# Altium schematic sheet u2f.SchDoc
size A4
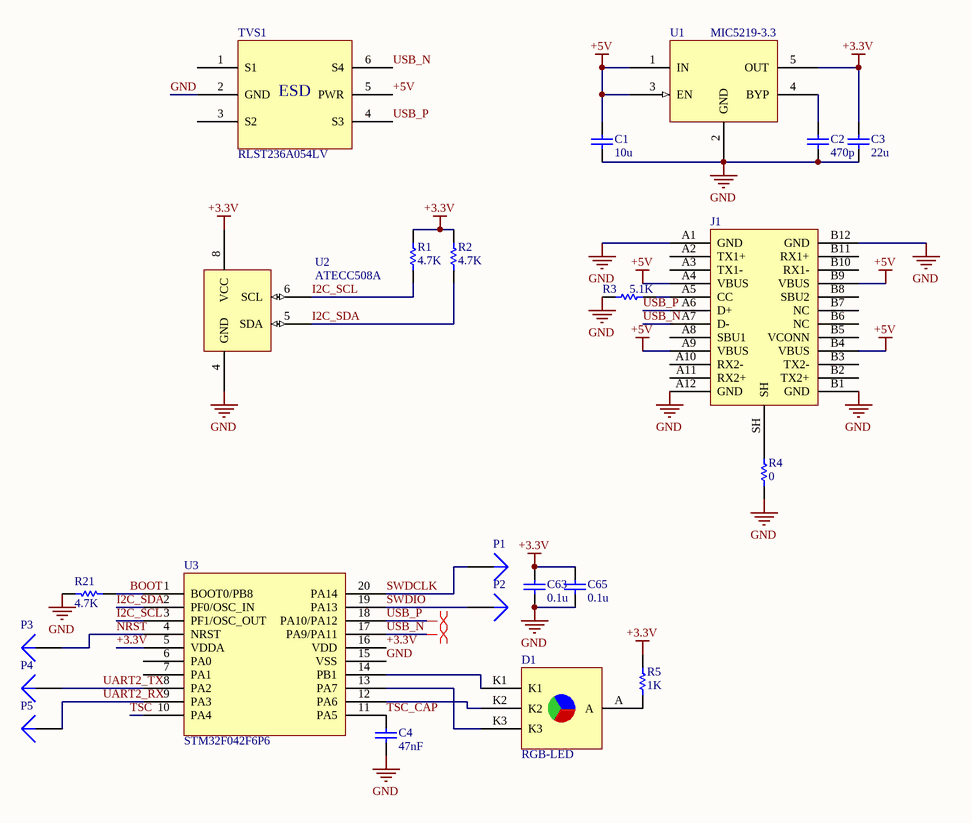
[diagram p0: u2f.SchDoc]

## Parts
C1  value 10u  [C-1608[0603]]  (hidden comment: Cap Semi)
C2  value 470p  [C-1608[0603]]  (hidden comment: Cap Semi)
C3  value 22u  [C-1608[0603]]  (hidden comment: Cap Semi)
C4  value 47nF  [C-1608[0603]]  (hidden comment: Cap Semi)
C63  value 0.1u  [C-1608[0603]]  (hidden comment: Cap Semi)
C65  value 0.1u  [C-1608[0603]]  (hidden comment: Cap Semi)
D1  RGB-LED  [LED-1615[0603x2]-RGB]
J1  USB-TypeC-Male  [USB-TypeC-Male]  (value not drawn)
P1  Plug  [TESTPOINT]  (value not drawn)
P2  Plug  [TESTPOINT]  (value not drawn)
P3  Plug  [TESTPOINT]  (value not drawn)
P4  Plug  [TESTPOINT]  (value not drawn)
P5  Plug  [TESTPOINT]  (value not drawn)
R1  value 4.7K  [R-1608[0603]]  (hidden comment: Res Semi)
R2  value 4.7K  [R-1608[0603]]  (hidden comment: Res Semi)
R3  value 5.1K  [R-1608[0603]]  (hidden comment: Res Semi)
R4  value 0  [R-1608[0603]]  (hidden comment: Res Semi)
R5  value 1K  [R-1608[0603]]  (hidden comment: Res Semi)
R21  value 4.7K  [R-1608[0603]]  (hidden comment: Res Semi)
TVS1  RLST236A054LV  [SOT23-6]
U1  MIC5219-3.3  [SOT23-5]
U2  ATECC508A  [SOP8-3D]
U3  STM32F042F6P6  [TSOP65P640X120-20N]

## Nets
+3.3V: C3.2 C63.2 C65.2 R1.2 R2.2 R5.2 U1.5(OUT) U2.8(VCC) U3.5(VDDA) U3.16(VDD)
+5V: C1.2 J1.A4(VBUS) J1.A9(VBUS) J1.B4(VBUS) J1.B9(VBUS) TVS1.5(PWR) U1.1(IN) U1.3(EN)
GND: C1.1 C2.1 C3.1 C4.1 C63.1 C65.1 J1.A1(GND) J1.A12(GND) J1.B1(GND) J1.B12(GND) R3.2 R4.1 R21.2 TVS1.2(GND) U1.2(GND) U2.4(GND) U3.15(VSS)
BOOT: R21.1 U3.1(BOOT0/PB8)
I2C_SCL: R1.1 U2.6(SCL) U3.3(PF1/OSC_OUT)
I2C_SDA: R2.1 U2.5(SDA) U3.2(PF0/OSC_IN)
NRST: P3.1 U3.4(NRST)
SWDCLK: P1.1 U3.20(PA14)
SWDIO: P2.1 U3.19(PA13)
TSC: U3.10(PA4)
TSC_CAP: C4.2 U3.11(PA5)
UART2_RX: P5.1 U3.9(PA3)
UART2_TX: P4.1 U3.8(PA2)
USB_N: J1.A7(D-) TVS1.6(S4) U3.17(PA9/PA11)
USB_P: J1.A6(D+) TVS1.4(S3) U3.18(PA10/PA12)
NetC2_2: C2.2 U1.4(BYP)
NetD1_A: D1.A R5.1
NetD1_K1: D1.K1 U3.14(PB1)
NetD1_K2: D1.K2 U3.12(PA6)
NetD1_K3: D1.K3 U3.13(PA7)
NetJ1_A5: J1.A5(CC) R3.1
NetJ1_SH: J1.SH R4.2

Not connected (* = marked no-connect by the designer): J1 A2(TX1+) A3(TX1-) A8(SBU1) A10(RX2-) A11(RX2+) B2(TX2+) B3(TX2-) B5(VCONN) B6(NC) B7(NC) B8(SBU2) B10(RX1-) B11(RX1+); TVS1 1(S1) 3(S2); U3 6(PA0) 7(PA1)

## Layout directives
differential pair: USB_N, USB_P

## Notes on the sheet
- (in symbol RLST236A054LV) ESD

## Library data of the parts
C1-C4 C63 C65 = Cap Semi: Capacitor (Semiconductor SIM Model); Published: 8-Jun-2000; LatestRevisionDate: 29-May-2009; LatestRevisionNote: IPC-7351 Footprint Added.; PackageReference: C1206; Publisher: Altium Limited; PackageDescription: Chip Capacitor
D1 = RGBLED_CA
R1-R5 R21 = Res Semi: Semiconductor Resistor; Published: 8-Jun-2000; LatestRevisionDate: 17-Jul-2002; LatestRevisionNote: Re-released for DXP Platform.; PackageReference: AXIAL-0.5; Publisher: Altium Limited; PackageDescription: Axial Device, Thru-Hole; 2 Leads; 0.5 in Pin Spacing
U1 = MIC5219: 500mA-Peak Output LDO Regulator
U3 = STM32F042FxP
P1-P5 = Plug: LatestRevisionDate: 17-Jul-2002; LatestRevisionNote: Re-released for DXP Platform.; Publisher: Altium Limited